# Altium schematic sheet SAMC21_Xplained_Pro_Target_MCU.SchDoc: Target MCU
size A3; Organization: ATMEL Norway; Address1: Vestre Rosten 79; Address2: N-7075 TILLER; Address3: NORWAY; DocumentNumber: A09-2419; Revision: 2; SheetNumber: 3; SheetTotal: 9; PageSetup: Record=PageOptions|CenterHorizontal=True|CenterVertical=True|PrintScale=1.01|XCorrection=1.00|YCorrection=1.00|PrintKind=1|BorderSize=5000000|LeftOffset=0|BottomOffset=0|Orientation=2|PaperLength=1000|PaperWidth=1000|Scale=100|PaperSource=15|PrintQuality=600|MediaType=1|DitherType=10|PrintScaleMode=1|PaperKind=A3 (297 x 420 mm)|PaperIndex=8
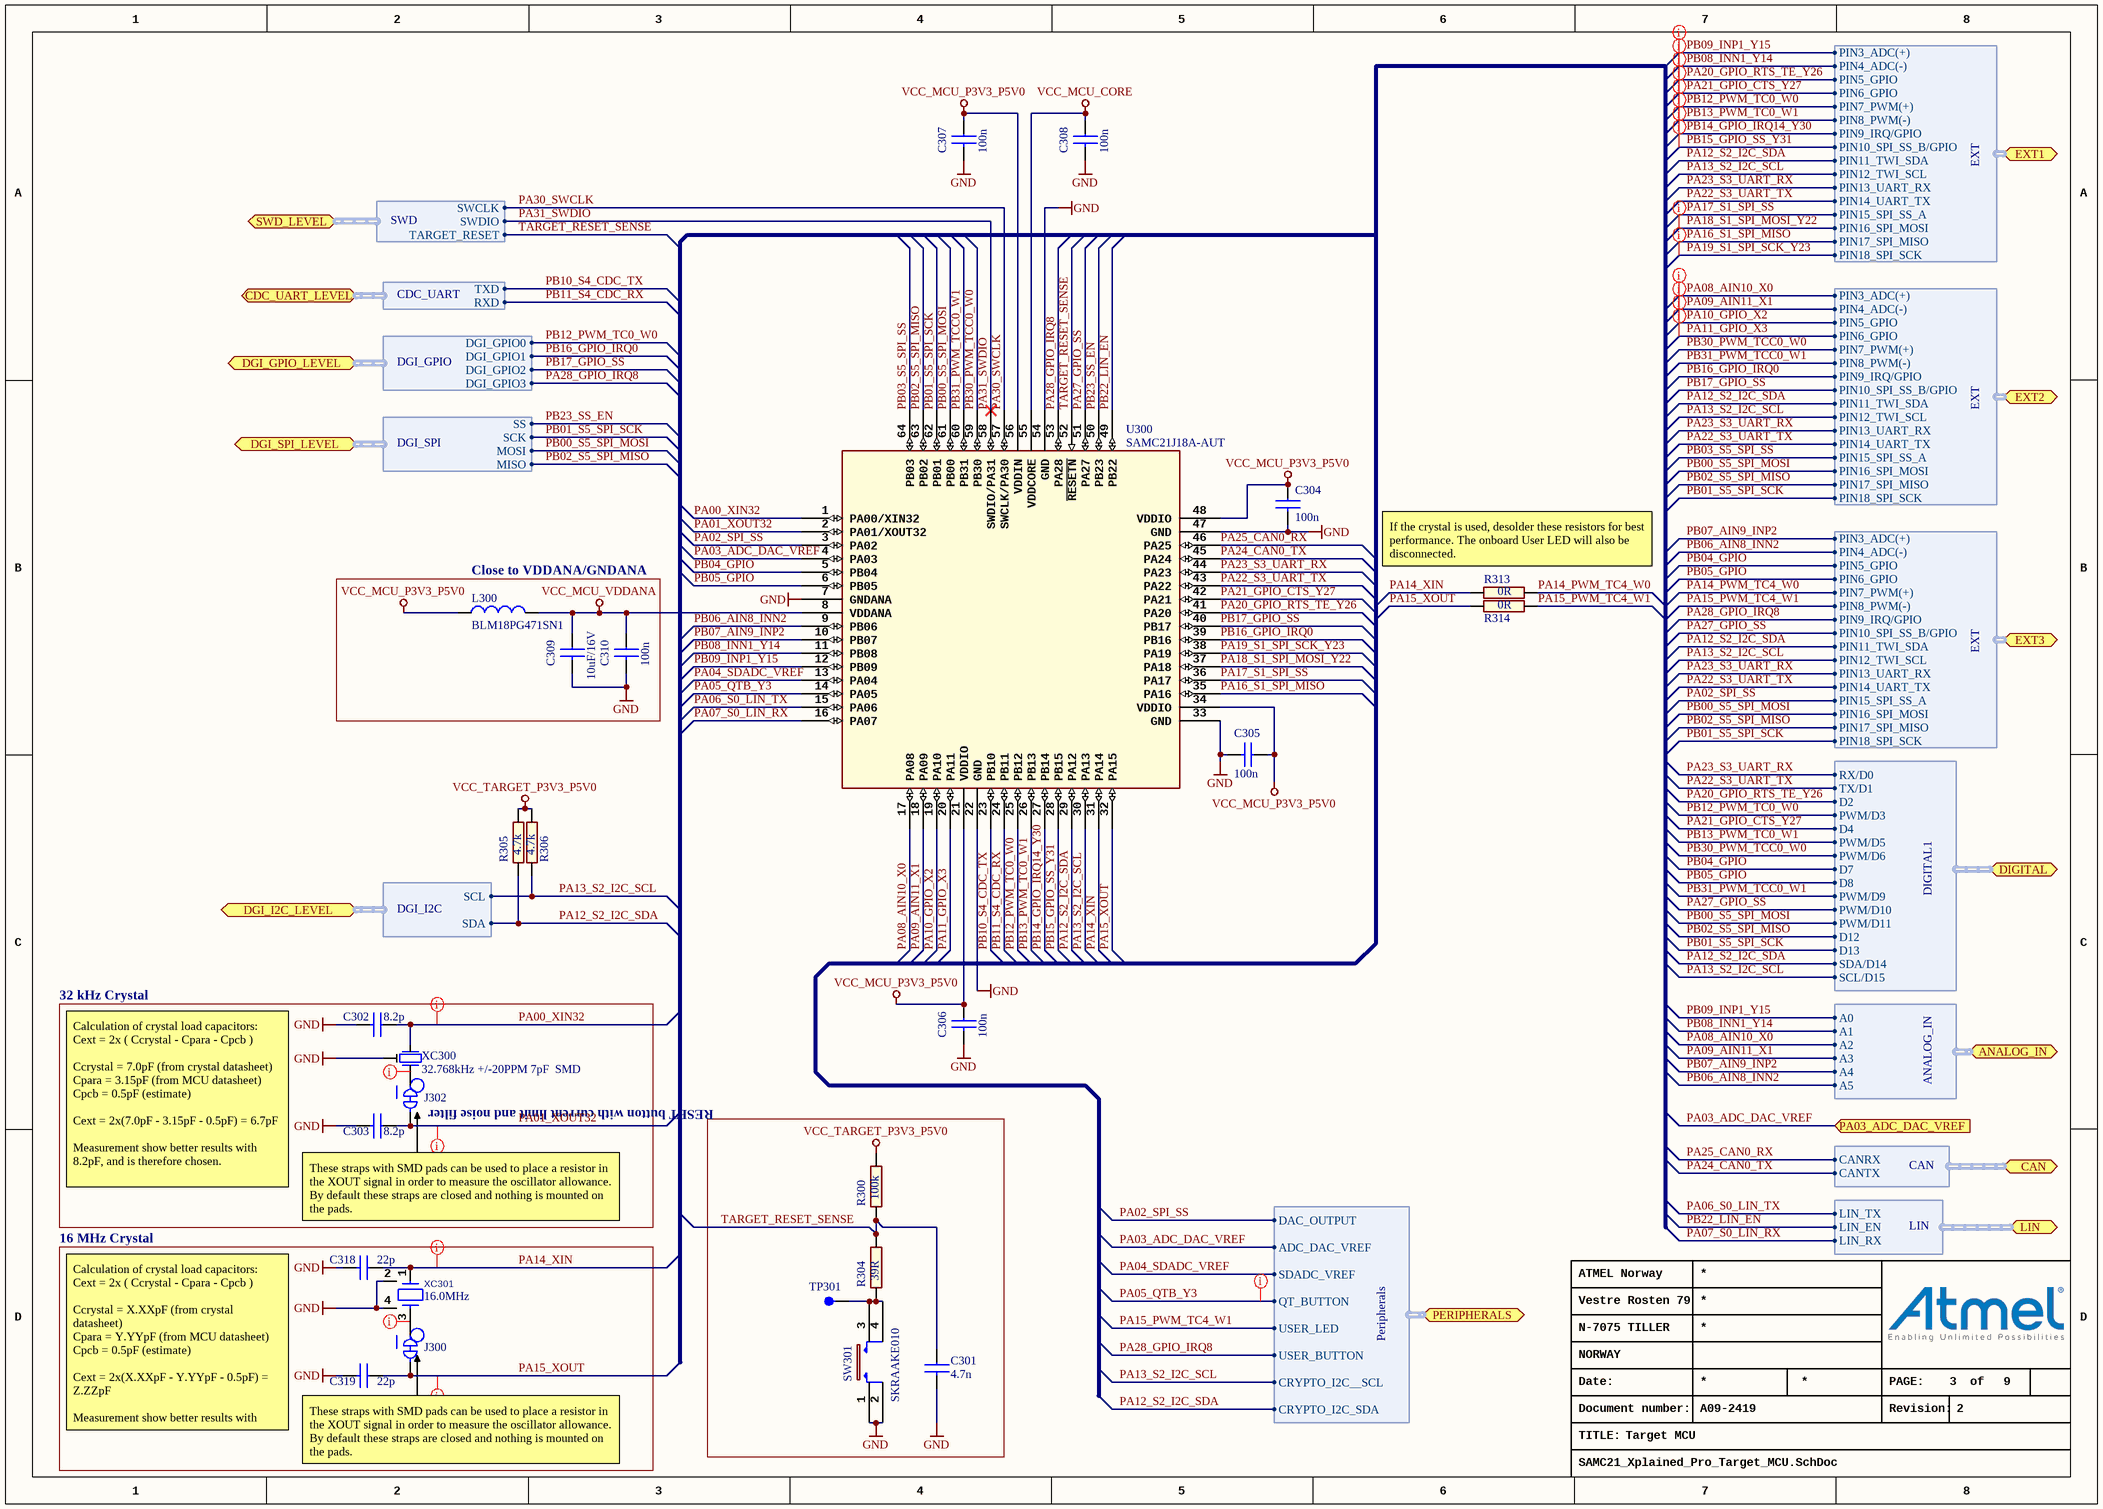
[diagram p0: SAMC21_Xplained_Pro_Target_MCU.SchDoc]

## Parts
C301  value 4.7n  [AP1-00001]  (hidden comment: CAP-NONPOL)
C302  value 8.2p  [AP1-00001]  (hidden comment: CAP-NONPOL)
C303  value 8.2p  [AP1-00001]  (hidden comment: CAP-NONPOL)
C304  value 100n  [AP1-00001]  (hidden comment: CAP-NONPOL)
C305  value 100n  [AP1-00001]  (hidden comment: CAP-NONPOL)
C306  value 100n  [AP1-00001]  (hidden comment: CAP-NONPOL)
C307  value 100n  [AP1-00001]  (hidden comment: CAP-NONPOL)
C308  value 100n  [AP1-00001]  (hidden comment: CAP-NONPOL)
C309  value 10uF/16V  [AP1-00039]  (hidden comment: CAP-NONPOL)
C310  value 100n  [AP1-00001]  (hidden comment: CAP-NONPOL)
C318  value 22p  [AP1-00001]  (hidden comment: CAP-NONPOL)
C319  value 22p  [AP1-00001]  (hidden comment: CAP-NONPOL)
J300  (no value)  [AP9-00044]  (net tie, no BOM)
J302  (no value)  [AP9-00044]  (net tie, no BOM)
L300  BLM18PG471SN1  [AP3-00005]
R300  value 100k  [AP2-00011]  (hidden comment: R2)
R304  value 39R  [AP2-00011]  (hidden comment: R2)
R305  value 4.7k  [AP2-00000]  (hidden comment: R2)
R306  value 4.7k  [AP2-00000]  (hidden comment: R2)
R313  value 0R  [AP2-00000]  (hidden comment: R2)
R314  value 0R  [AP2-00000]  (hidden comment: R2)
SW301  value SKRAAKE010  [AP8-00137]  (hidden comment: Can be ordered in low volumes from Mouser)
TP301  TESTPOINT  [AP8-00010]  (value not drawn)  (no BOM)
U300  value SAMC21J18A-AUT  [AP6-00173]  (hidden comment: SAMC21J_TQFP64)
XC300  value 32.768kHz +/-20PPM 7pF  SMD  [AP7-00044]  (hidden comment: Farnell order no:1539364)
XC301  value 16.0MHz  [AP7-00061]  (hidden comment: TSX-3225)

## Blocks framed on the sheet
Close to VDDANA/GNDANA: C309 C310 L300
32 kHz Crystal: C302 C303 J302 XC300
RESET button with current limit and noise filter: C301 R300 R304 SW301 TP301
16 MHz Crystal: C318 C319 J300 XC301

## Ports
ANALOG_IN (harness ANALOG_IN), CAN (harness CAN), CDC_UART_LEVEL (harness CDC_UART), DGI_GPIO_LEVEL (harness DGI_GPIO), DGI_I2C_LEVEL (harness DGI_I2C), DGI_SPI_LEVEL (harness DGI_SPI), DIGITAL (harness DIGITAL1), EXT1 (harness EXT), EXT2 (harness EXT), EXT3 (harness EXT), LIN (harness LIN), PA03_ADC_DAC_VREF (in), PERIPHERALS (harness Peripherals), SWD_LEVEL (harness SWD)

## Harnesses
SWD: SWCLK, SWDIO, TARGET_RESET
DGI_GPIO: DGI_GPIO0, DGI_GPIO1, DGI_GPIO2, DGI_GPIO3
DGI_SPI: MISO, MOSI, SCK, SS
DGI_I2C: SCL, SDA
CDC_UART: RXD, TXD
EXT: PIN10_SPI_SS_B/GPIO, PIN11_TWI_SDA, PIN12_TWI_SCL, PIN13_UART_RX, PIN14_UART_TX, PIN15_SPI_SS_A, PIN16_SPI_MOSI, PIN17_SPI_MISO, PIN18_SPI_SCK, PIN3_ADC(+), PIN4_ADC(-), PIN5_GPIO, PIN6_GPIO, PIN7_PWM(+), PIN8_PWM(-), PIN9_IRQ/GPIO
DIGITAL1: RX/D0, TX/D1, D2, PWM/D3, D4, PWM/D5, PWM/D6, D7, D8, PWM/D9, PWM/D10, PWM/D11, D12, D13, SDA/D14, SCL/D15
ANALOG_IN: A0, A1, A2, A3, A4, A5
CAN: CANTX, CANRX
LIN: LIN_RX, LIN_EN, LIN_TX
Peripherals: DAC_OUTPUT, ADC_DAC_VREF, SDADC_VREF, QT_BUTTON, USER_LED, USER_BUTTON, CRYPTO_I2C__SCL, CRYPTO_I2C_SDA

## Nets
GND: C301.2 C302.2 C303.2 C304.2 C305.2 C306.2 C307.2 C308.2 C309.2 C310.2 C318.2 C319.2 SW301.1 SW301.2 U300.7(GNDANA) U300.22(GND) U300.33(GND) U300.47(GND) U300.54(GND) XC300.3 XC301.2(GND) XC301.4(GND)
VCC_MCU_CORE: C308.1 U300.55(VDDCORE)
VCC_MCU_P3V3_P5V0: C304.1 C305.1 C306.1 C307.1 L300.1 U300.21(VDDIO) U300.34(VDDIO) U300.48(VDDIO) U300.56(VDDIN)
VCC_MCU_VDDANA: C309.1 C310.1 L300.2 U300.8(VDDANA)
VCC_TARGET_P3V3_P5V0: R300.2 R305.2 R306.2
PA00_XIN32: C302.1 U300.1(PA00/XIN32) XC300.2
PA01_XOUT32: C303.1 J302.2 U300.2(PA01/XOUT32)
PA02_SPI_SS: U300.3(PA02) ; port EXT3.PIN15_SPI_SS_A, port PERIPHERALS.DAC_OUTPUT
PA03_ADC_DAC_VREF: U300.4(PA03) ; port PA03_ADC_DAC_VREF, port PERIPHERALS.ADC_DAC_VREF
PA04_SDADC_VREF: U300.13(PA04) ; port PERIPHERALS.SDADC_VREF
PA05_QTB_Y3: U300.14(PA05) ; port PERIPHERALS.QT_BUTTON
PA06_S0_LIN_TX: U300.15(PA06) ; port LIN.LIN_TX
PA07_S0_LIN_RX: U300.16(PA07) ; port LIN.LIN_RX
PA08_AIN10_X0: U300.17(PA08) ; port EXT2.PIN3_ADC(+), port ANALOG_IN.A2
PA09_AIN11_X1: U300.18(PA09) ; port EXT2.PIN4_ADC(-), port ANALOG_IN.A3
PA10_GPIO_X2: U300.19(PA10) ; port EXT2.PIN5_GPIO
PA11_GPIO_X3: U300.20(PA11) ; port EXT2.PIN6_GPIO
PA12_S2_I2C_SDA: R305.1 U300.29(PA12) ; port DGI_I2C_LEVEL.SDA, port EXT1.PIN11_TWI_SDA, port EXT2.PIN11_TWI_SDA, port EXT3.PIN11_TWI_SDA, port DIGITAL.SDA/D14, port PERIPHERALS.CRYPTO_I2C_SDA
PA13_S2_I2C_SCL: R306.1 U300.30(PA13) ; port DGI_I2C_LEVEL.SCL, port EXT1.PIN12_TWI_SCL, port EXT2.PIN12_TWI_SCL, port EXT3.PIN12_TWI_SCL, port DIGITAL.SCL/D15, port PERIPHERALS.CRYPTO_I2C__SCL
PA14_PWM_TC4_W0: R313.2 ; port EXT3.PIN7_PWM(+)
PA14_XIN: C318.1 R313.1 U300.31(PA14) XC301.1(IN)
PA15_PWM_TC4_W1: R314.2 ; port EXT3.PIN8_PWM(-), port PERIPHERALS.USER_LED
PA15_XOUT: C319.1 J300.2 R314.1 U300.32(PA15)
PA16_S1_SPI_MISO: U300.35(PA16) ; port EXT1.PIN17_SPI_MISO
PA17_S1_SPI_SS: U300.36(PA17) ; port EXT1.PIN15_SPI_SS_A
PA18_S1_SPI_MOSI_Y22: U300.37(PA18) ; port EXT1.PIN16_SPI_MOSI
PA19_S1_SPI_SCK_Y23: U300.38(PA19) ; port EXT1.PIN18_SPI_SCK
PA20_GPIO_RTS_TE_Y26: U300.41(PA20) ; port EXT1.PIN5_GPIO, port DIGITAL.D2
PA21_GPIO_CTS_Y27: U300.42(PA21) ; port EXT1.PIN6_GPIO, port DIGITAL.D4
PA22_S3_UART_TX: U300.43(PA22) ; port EXT1.PIN14_UART_TX, port EXT2.PIN14_UART_TX, port EXT3.PIN14_UART_TX, port DIGITAL.TX/D1
PA23_S3_UART_RX: U300.44(PA23) ; port EXT1.PIN13_UART_RX, port EXT2.PIN13_UART_RX, port EXT3.PIN13_UART_RX, port DIGITAL.RX/D0
PA24_CAN0_TX: U300.45(PA24) ; port CAN.CANTX
PA25_CAN0_RX: U300.46(PA25) ; port CAN.CANRX
PA27_GPIO_SS: U300.51(PA27) ; port EXT3.PIN10_SPI_SS_B/GPIO, port DIGITAL.PWM/D10
PA28_GPIO_IRQ8: U300.53(PA28) ; port DGI_GPIO_LEVEL.DGI_GPIO3, port EXT3.PIN9_IRQ/GPIO, port PERIPHERALS.USER_BUTTON
PA30_SWCLK: U300.57(SWCLK/PA30) ; port SWD_LEVEL.SWCLK
PA31_SWDIO: U300.58(SWDIO/PA31) ; port SWD_LEVEL.SWDIO
PB00_S5_SPI_MOSI: U300.61(PB00) ; port DGI_SPI_LEVEL.MOSI, port EXT2.PIN16_SPI_MOSI, port EXT3.PIN16_SPI_MOSI, port DIGITAL.PWM/D11
PB01_S5_SPI_SCK: U300.62(PB01) ; port DGI_SPI_LEVEL.SCK, port EXT2.PIN18_SPI_SCK, port EXT3.PIN18_SPI_SCK, port DIGITAL.D13
PB02_S5_SPI_MISO: U300.63(PB02) ; port DGI_SPI_LEVEL.MISO, port EXT2.PIN17_SPI_MISO, port EXT3.PIN17_SPI_MISO, port DIGITAL.D12
PB03_S5_SPI_SS: U300.64(PB03) ; port EXT2.PIN15_SPI_SS_A
PB04_GPIO: U300.5(PB04) ; port EXT3.PIN5_GPIO, port DIGITAL.D7
PB05_GPIO: U300.6(PB05) ; port EXT3.PIN6_GPIO, port DIGITAL.D8
PB06_AIN8_INN2: U300.9(PB06) ; port EXT3.PIN4_ADC(-), port ANALOG_IN.A5
PB07_AIN9_INP2: U300.10(PB07) ; port EXT3.PIN3_ADC(+), port ANALOG_IN.A4
PB08_INN1_Y14: U300.11(PB08) ; port EXT1.PIN4_ADC(-), port ANALOG_IN.A1
PB09_INP1_Y15: U300.12(PB09) ; port EXT1.PIN3_ADC(+), port ANALOG_IN.A0
PB10_S4_CDC_TX: U300.23(PB10) ; port CDC_UART_LEVEL.TXD
PB11_S4_CDC_RX: U300.24(PB11) ; port CDC_UART_LEVEL.RXD
PB12_PWM_TC0_W0: U300.25(PB12) ; port DGI_GPIO_LEVEL.DGI_GPIO0, port EXT1.PIN7_PWM(+), port DIGITAL.PWM/D3
PB13_PWM_TC0_W1: U300.26(PB13) ; port EXT1.PIN8_PWM(-), port DIGITAL.PWM/D5
PB14_GPIO_IRQ14_Y30: U300.27(PB14) ; port EXT1.PIN9_IRQ/GPIO
PB15_GPIO_SS_Y31: U300.28(PB15) ; port EXT1.PIN10_SPI_SS_B/GPIO
PB16_GPIO_IRQ0: U300.39(PB16) ; port DGI_GPIO_LEVEL.DGI_GPIO1, port EXT2.PIN9_IRQ/GPIO
PB17_GPIO_SS: U300.40(PB17) ; port DGI_GPIO_LEVEL.DGI_GPIO2, port EXT2.PIN10_SPI_SS_B/GPIO
PB22_LIN_EN: U300.49(PB22) ; port LIN.LIN_EN
PB23_SS_EN: U300.50(PB23) ; port DGI_SPI_LEVEL.SS
PB30_PWM_TCC0_W0: U300.59(PB30) ; port EXT2.PIN7_PWM(+), port DIGITAL.PWM/D6
PB31_PWM_TCC0_W1: U300.60(PB31) ; port EXT2.PIN8_PWM(-), port DIGITAL.PWM/D9
TARGET_RESET_SENSE: C301.1 R300.1 R304.2 U300.52(~{RESETN}) ; port SWD_LEVEL.TARGET_RESET
NetJ300_1: J300.1 XC301.3(OUT)
NetJ302_1: J302.1 XC300.1
NetR304_1: R304.1 SW301.3 SW301.4 TP301.1

## Layout directives
rule Assembly Testpoint Usage [Testpoint - Not Allowed    Multiple - Not Allowed]: NetJ300_1, NetJ302_1, PA00_XIN32, PA01_XOUT32, PA14_XIN, PA15_XOUT
net class TOUCH; rule Clearance Constraint [Clearance = 0.6mm]: PA05_QTB_Y3, PA08_AIN10_X0, PA09_AIN11_X1, PA10_GPIO_X2, PA11_GPIO_X3, PA18_S1_SPI_MOSI_Y22, PA19_S1_SPI_SCK_Y23, PA20_GPIO_RTS_TE_Y26, PA21_GPIO_CTS_Y27, PB08_INN1_Y14, PB09_INP1_Y15, PB12_PWM_TC0_W0, PB13_PWM_TC0_W1, PB14_GPIO_IRQ14_Y30, PB15_GPIO_SS_Y31

## Notes on the sheet
- If the crystal is used, desolder these resistors for best performance. The onboard User LED will also be disconnected.
- Calculation of crystal load capacitors:
  Cext = 2x ( Ccrystal - Cpara - Cpcb )
  Ccrystal = 7.0pF (from crystal datasheet)
  Cpara = 3.15pF (from MCU datasheet)
  Cpcb = 0.5pF (estimate)
  Cext = 2x(7.0pF - 3.15pF - 0.5pF) = 6.7pF
  Measurement show better results with 8.2pF, and is therefore chosen.
- These straps with SMD pads can be used to place a resistor in the XOUT signal in order to measure the oscillator allowance.
  By default these straps are closed and nothing is mounted on the pads.
- Calculation of crystal load capacitors:
  Cext = 2x ( Ccrystal - Cpara - Cpcb )
  Ccrystal = X.XXpF (from crystal datasheet)
  Cpara = Y.YYpF (from MCU datasheet)
  Cpcb = 0.5pF (estimate)
  Cext = 2x(X.XXpF - Y.YYpF - 0.5pF) = Z.ZZpF
  Measurement show better results with N.NNpF, and is therefore chosen.
- Date:
- PAGE:
- of
- TITLE:
- Document number:
- Revision:

## Library data of the parts
C301 = A01-0046: Ceramic capacitor, SMD 0402, X7R, 25V, +/-10% (de35287); PartGroup: Capacitors,Ceramic,SMD 0402; TemperatureRange: -55 - +125 deg C; AN: A01-0046; Tolerance: 25V, +/-10%; Height: 0.550000011920929
C302 C303 = A01-0014: Ceramic capacitor, SMD 0402, NP0, 50V, +/-5%; PartGroup: Capacitors,Ceramic,SMD 0402; TemperatureRange: -55 - +125 deg C; AN: A01-0014; Tolerance: 50V, +/-5%; Height: 0,550000011920929
C304-C308 C310 = A01-0246: Ceramic capacitor, SMD 0402, X7R, 16V, +/-10%; PartGroup: Capacitors,Ceramic,SMD 0402; Manufacturer: Kemet; MPN: C0402C104K4RACTU; TemperatureRange: -55 - +125 deg C; AN: A01-0246; Tolerance: 16V, +/-10%; Height: 0,5
C309 = A01-0491: Ceramic capacitor, SMD 0603, X5R, 16V, 10UF ± 20% (High Density); PartGroup: Capacitors,Ceramic,SMD 0603; Manufacturer: Taiyo Yuden; MPN: EMK107BBJ106MA-T; AN: A01-0491
C318 C319 = A01-0019: Ceramic capacitor, SMD 0402, NP0, 50V, +/-5%; PartGroup: Capacitors,Ceramic,SMD 0402; TemperatureRange: -55 - +125 deg C; AN: A01-0019; Tolerance: 50V, +/-5%; Height: 0.550000011920929
J300 J302 = A09-0783: Default closed SMD strap, 0603 size; PartGroup: Mechanical devices,PCB implemented components; Value: SMD-STRAP_0603_CLOSED; AN: A09-0783; Height: 0
L300 = A03-0035: SMD RF inductor 0603. Z=470Ohm (@100MHz), Max R(dc)=0.65Ohm, Max current=1A; PartGroup: Inductors,EMI; Manufacturer: Murata; Tolerance: ±25%; TemperatureRange: -55°C to +125°C; AN: A03-0035; Value: BLM18PG471SN1; Height: 0,800000011920929; MPN: BLM18PG471SN1
R300 = A02-0260: Thick film resistor, SMD 0402, 1/16W, 1%; PartGroup: Resistors,SMD,0402 1%; TemperatureRange: -55 - +125 deg C; AN: A02-0260; Tolerance: 1 %; Height: 0,349999994039536
R304 = A02-0178: Thick film resistor, SMD 0402, 1/16W, 1%; PartGroup: Resistors,SMD,0402 1%; TemperatureRange: -55 - +125 deg C; AN: A02-0178; Tolerance: 1 %; Height: 0,349999994039536
R305 R306 = A02-0228: Thick film resistor, SMD 0402, 1/16W, 1%; PartGroup: Resistors,SMD,0402 1%; TemperatureRange: -55 - +125 deg C; AN: A02-0228; Tolerance: 1 %; Height: 0.349999994039536
R313 R314 = A02-0163: Thick film resistor, SMD 0402, 1/16W, 1%; PartGroup: Resistors,SMD,0402 1%; TemperatureRange: -55 - +125 deg C; AN: A02-0163; Tolerance: 1 %; Height: 0.349999994039536
SW301 = A08-0790: 6.2x6.2 mm SMD tact switch, same as A08-0091 but less force is needed; PartGroup: Mechanical devices,Switches,SMD; Manufacturer: ALPS; TemperatureRange: -30 - +90 deg C; AN: A08-0790; Height: 5,09999990463257; MPN: SKRAAKE010
TP301 = A08-0004: Single SMD testpad; PartGroup: Mechanical devices,Connectors,Test points; AN: A08-0004; Value: TESTPAD; Height: 0
U300 = A06-1192: Atmel 32-bit RISC MCU 64pin; PartGroup: Integrated Circuits,MCU, MPU, DSP,ARM MCU; TemperatureRange: -40Â°C to +105Â°C; Design comment: *; AN: A06-1192; Height: 1.20000004768372; Manufacturer: ATMEL; MPN: SAMC21J18A-AUT
XC300 = A07-0052: 32k768 crystal, +-20ppm, CL=7pF, max ESR 60kOhm, SMD; PartGroup: Frequency devices,Crystals,SMD; Manufacturer: Micro Crystal; MPN: MS1V-T1K 32.768kHz 7pF +/-20PPM TA; Tolerance: +/- 20 PPM; TemperatureRange: -40 /+85; AN: A07-0052; Height: 2.07999992370605
XC301 = A07-0078: 16MHz uXtal, 3.2 x 2.5 mm SMD, CL=9pF, 15PPM, ESR=80ohm(Max.; PartGroup: Frequency devices,Crystals,SMD; Manufacturer: Epson Toyocom; MPN: TSX-3225 16.0000MF09Z-AC3; TemperatureRange: -40Â°C to +85Â°C; AN: A07-0078; Tolerance: 15ppm; Height: 0.699999988079071